# Altium schematic sheet module 3_GROVE.SchDoc
size 280 x 148 mm
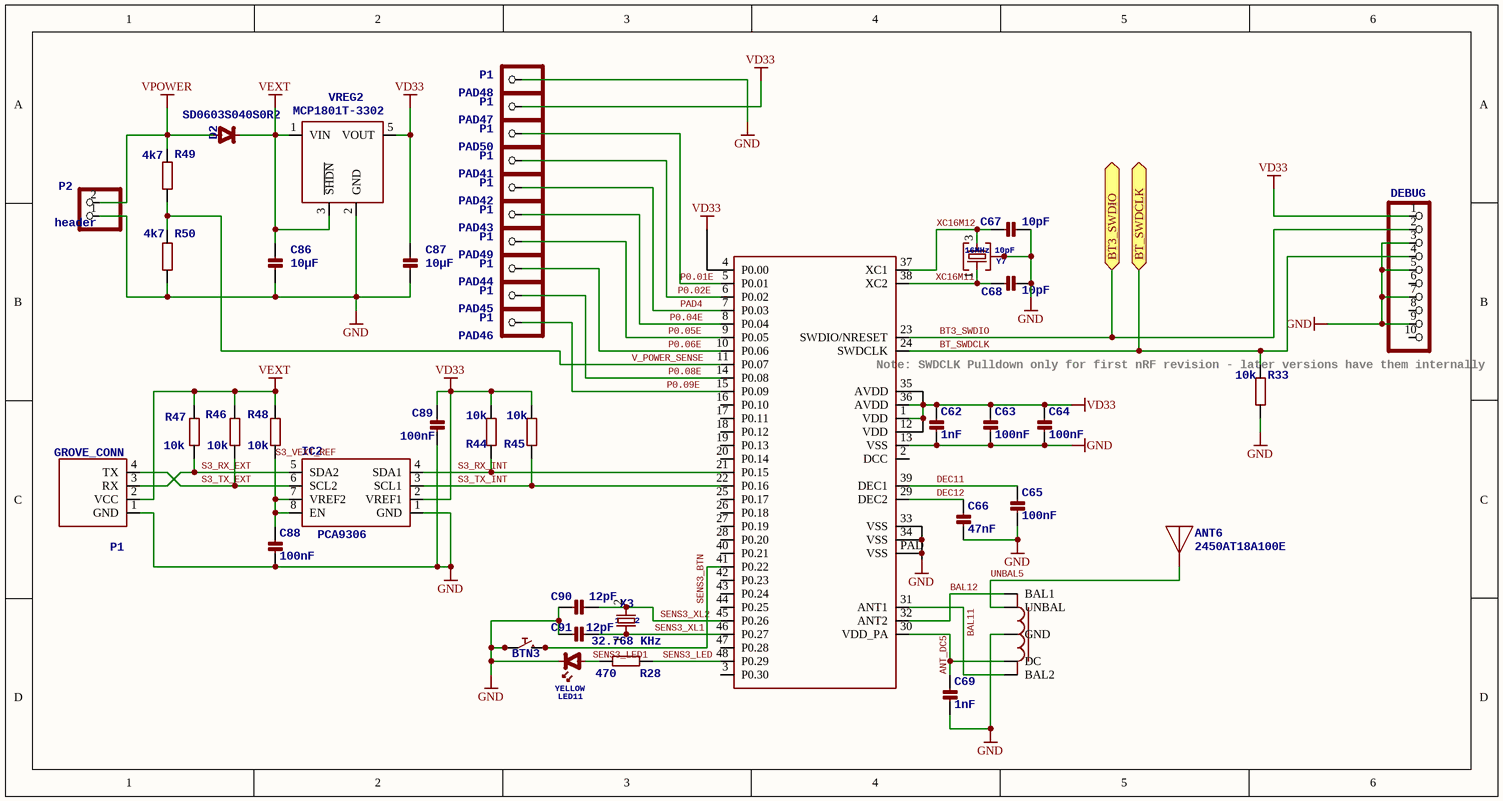
[diagram p0: module 3_GROVE.SchDoc]

## Parts
ANT6  2450AT18A100E  [1206_MINIMELF_COMBO]
BALUN3  2450BM14A0002T  [6-PIN-0603]  (value not drawn)
BT3  NRF51822QFN48  [QFN48_EP]  (value not drawn)
BTN3  Tact Sw 4.6x2.8  [CK-KMR2]  (value not drawn)
C62  1nF  [0402]
C63  100nF  [0402]
C64  100nF  [0402]
C65  100nF  [0402]
C66  47nF  [0402]
C67  10pF  [0402]
C68  10pF  [0402]
C69  1nF  [0402]
C86  10µF  [0603]
C87  10µF  [0603]
C88  100nF  [0402]
C89  100nF  [0402]
C90  12pF  [0402]
C91  12pF  [0402]
D2  SD0603S040S0R2  [0603_POLAR]
DEBUG3  DEBUG  [2X05_SMT]  (no BOM)
IC2  PCA9306  [US8]
LED11  YELLOW  [0402_POLAR]
P1  GROVE_CONN  [GROVE-CONN-TH]
P2  header  [1X02_ROUND]  (no BOM)
PAD41  P1  [PCB_MEDIUM_RECT_PAD]  (no BOM)
PAD42  P1  [PCB_MEDIUM_RECT_PAD]  (no BOM)
PAD43  P1  [PCB_MEDIUM_RECT_PAD]  (no BOM)
PAD44  P1  [PCB_MEDIUM_RECT_PAD]  (no BOM)
PAD45  P1  [PCB_MEDIUM_RECT_PAD]  (no BOM)
PAD46  P1  [PCB_MEDIUM_RECT_PAD]  (no BOM)
PAD47  P1  [PCB_MEDIUM_RECT_PAD]  (no BOM)
PAD48  P1  [PCB_MEDIUM_RECT_PAD]  (no BOM)
PAD49  P1  [PCB_MEDIUM_RECT_PAD]  (no BOM)
PAD50  P1  [PCB_MEDIUM_RECT_PAD]  (no BOM)
R28  470  [0402]
R33  10k  [0402]
R44  10k  [0402]
R45  10k  [0402]
R46  10k  [0402]
R47  10k  [0402]
R48  10k  [0402]
R49  4k7  [0402]
R50  4k7  [0402]
VREG2  MCP1801T-3302  [SOT-23-5]
X3  32.768 KHz  [1206_MINIMELF_COMBO]
Y7  16MHz 10pF  [CRYSTAL25X20]

## Ports
BT3_SWDIO, BT_SWDCLK

## Nets
GND: BALUN3.2(GND) BT3.13(VSS) BT3.33(VSS) BT3.34(VSS) BT3.PAD(VSS) BTN3.P1 BTN3.P2 C62.2 C63.2 C64.2 C65.2 C66.2 C67.2 C68.2 C69.2 C86.2(P2) C87.2(P2) C88.2 C89.2 C90.1 C91.1 DEBUG3.3 DEBUG3.5 DEBUG3.7 DEBUG3.9 IC2.1(GND) LED11.K(CATHODE) P1.1(GND) P2.1 PAD48.1 R33.1 R50.1 VREG2.2(GND) Y7.2 Y7.4
VD33: BT3.1(VDD) BT3.4(P0.00) BT3.12(VDD) BT3.35(AVDD) BT3.36(AVDD) C62.1 C63.1 C64.1 C87.1(P1) C89.1 DEBUG3.1 IC2.2(VREF1) PAD47.1 R44.2 R45.2 VREG2.5(VOUT)
VEXT: C86.1(P1) D2.K(CATHODE) P1.2(VCC) R46.2 R47.2 R48.2 VREG2.1(VIN) VREG2.3(~{SHDN})
VPOWER: D2.A(ANODE) P2.2 R49.2
ANT_DC5: BALUN3.5(DC) BT3.30(VDD_PA) C69.1
BAL11: BALUN3.4(BAL2) BT3.31(ANT1)
BAL12: BALUN3.3(BAL1) BT3.32(ANT2)
BT3_SWDIO: BT3.23(SWDIO/NRESET) DEBUG3.2 ; port BT3_SWDIO
BT_SWDCLK: BT3.24(SWDCLK) DEBUG3.4 R33.2 ; port BT_SWDCLK
DEC11: BT3.39(DEC1) C65.1
DEC12: BT3.29(DEC2) C66.1
P0.01E: BT3.5(P0.01) PAD50.1
P0.02E: BT3.6(P0.02) PAD41.1
P0.04E: BT3.8(P0.04) PAD43.1
P0.05E: BT3.9(P0.05) PAD49.1
P0.06E: BT3.10(P0.06) PAD44.1
P0.08E: BT3.14(P0.08) PAD45.1
P0.09E: BT3.15(P0.09) PAD46.1
PAD4: BT3.7(P0.03) PAD42.1
S3_RX_EXT: IC2.5(SDA2) P1.3(RX) R47.1
S3_RX_INT: BT3.21(P0.15) IC2.4(SDA1) R44.1
S3_TX_EXT: IC2.6(SCL2) P1.4(TX) R46.1
S3_TX_INT: BT3.22(P0.16) IC2.3(SCL1) R45.1
S3_VEXT_REF: C88.1 IC2.7(VREF2) IC2.8(EN) R48.1
SENS3_BTN: BT3.41(P0.22) BTN3.P3 BTN3.P4
SENS3_LED: BT3.48(P0.29) R28.1
SENS3_LED1: LED11.A(ANODE) R28.2
SENS3_XL1: BT3.46(P0.27) C91.2 X3.1
SENS3_XL2: BT3.45(P0.26) C90.2 X3.2
UNBAL5: ANT6.1(ANT) BALUN3.1(UNBAL)
V_POWER_SENSE: BT3.11(P0.07) R49.1 R50.2
XC16M11: BT3.38(XC2) C68.1 Y7.1
XC16M12: BT3.37(XC1) C67.1 Y7.3

Not connected (* = marked no-connect by the designer): BT3 2(DCC) 3(P0.30) 16(P0.10) 17(P0.11) 18(P0.12) 19(P0.13) 20(P0.14) 25(P0.17) 26(P0.18) 27(P0.19) 28(P0.20) 40(P0.21) 42(P0.23) 43(P0.24) 44(P0.25) 47(P0.28); DEBUG3 6 8 10

## Notes on the sheet
- (near BT3) Note: SWDCLK Pulldown only for first nRF revision - later versions have them internally

## Library data of the parts
ANT6 = ANTENNA_MONOPOLE1206: 2.45 GHz Antenna; SMD: Yes
BALUN3 = BALUN: 2.45 GHz Impedance Matched Balun-Filter; SMD: Yes
BT3 = NRF51822QFN48: Nordic Bluetooth 4.0 low energy modul; SMD: Yes
BTN3 = PUSHBUTTONKMR2XX: Push button; SMD: Yes
C62-C69 C88-C91 = CAP_CERAMIC0402: Ceramic Capacitor; SMD: Yes
C86 C87 = CAP_CERAMIC0603: Ceramic Capacitor; SMD: Yes
D2 = DIODE0603: Shottky diode 40V 0.2A; SMD: Yes
DEBUG3 = HEADER-2X5SMD-1.27MM: cortex DEBUG connector
IC2 = PCA9306US8: I2C bidirectional level translator; SMD: Yes
LED11 = LED0402: LED common; SMD: Yes
P1 = GROVE_CONNV: Seeed Grove 4-pin 2mm connector; SMD: No
P2 = HEADER-1X2ROUND: PIN HEADER; SMD: No
PAD41-PAD50 = HEADER-1X1SMD_MEDIUM: <b>PIN HEADER</b>
R28 R33 R44-R50 = R-EU_0402: RESISTOR; SMD: Yes
VREG2 = MCP180XSOT-23-5: Microchip LDO; SMD: Yes
X3 = CRYSTAL1206: CL05C120JB5; 1: 1; 2: 2; SMD: Yes
Y7 = CRYSTAL_WITH_GROUND25X20: 16MHz crystal 2.5x2mm; SMD: Yes